# Altium schematic sheet Sheet1.SchDoc
size OrCAD A; SheetNumber: 1; SheetTotal: 1
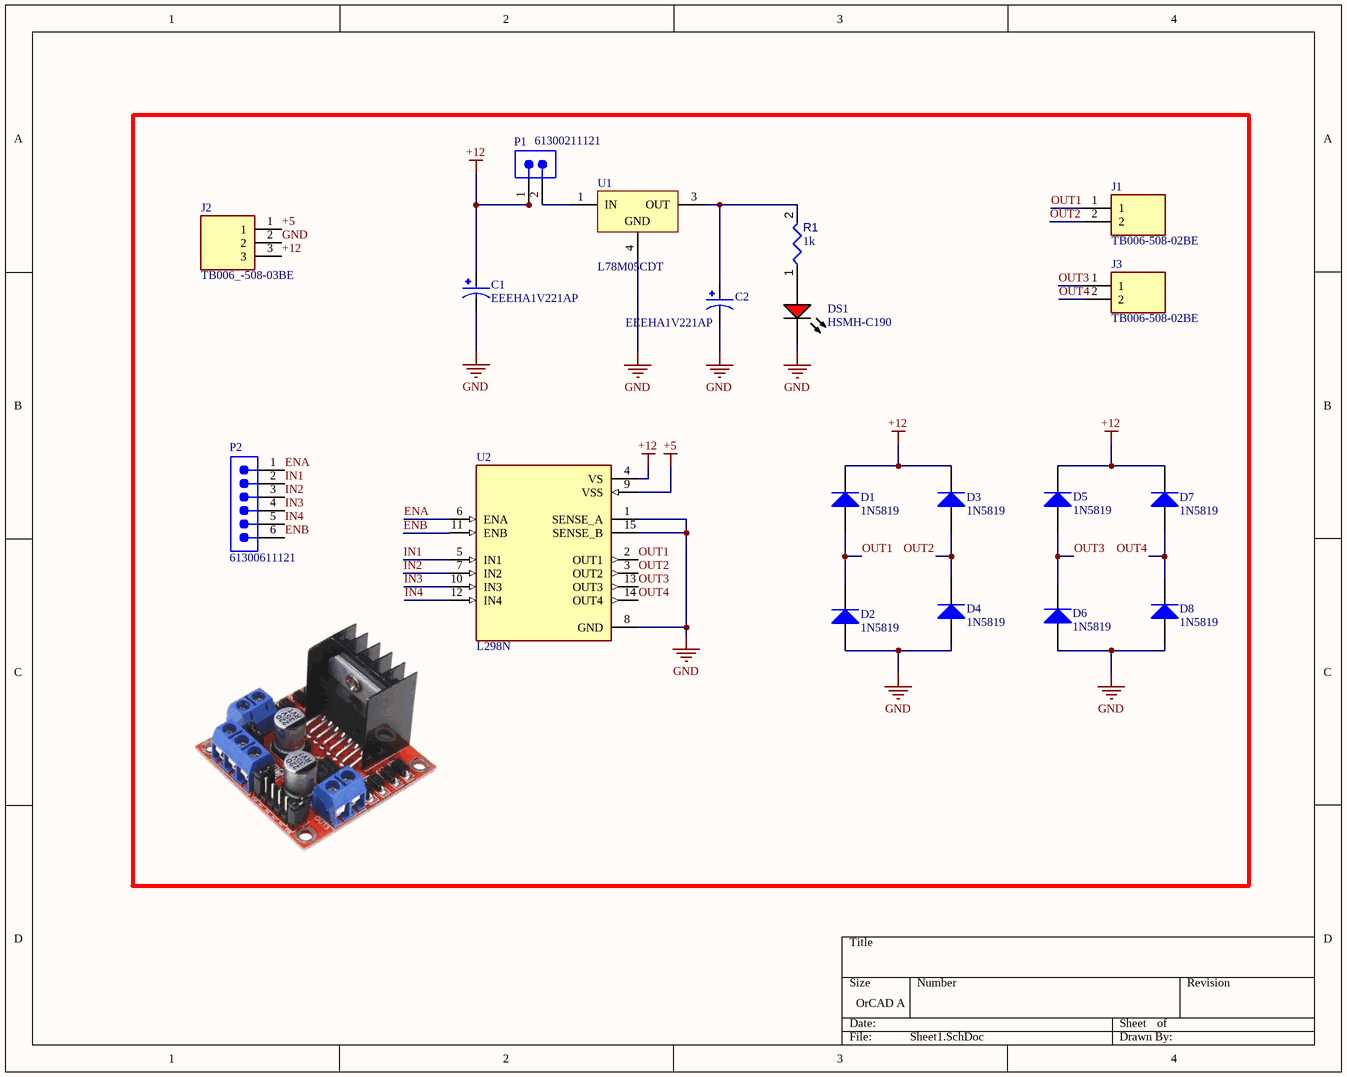
[diagram p0: Sheet1.SchDoc]

## Parts
C1  EEEHA1V221AP  [CAP_EEEHA1V221AP]
C2  EEEHA1V221AP  [CAP_EEEHA1V221AP]
D1  1N5819  [ONSC-AXIAL_LEAD-2-59-10_P]
D2  1N5819  [ONSC-AXIAL_LEAD-2-59-10_P]
D3  1N5819  [ONSC-AXIAL_LEAD-2-59-10_P]
D4  1N5819  [ONSC-AXIAL_LEAD-2-59-10_P]
D5  1N5819  [ONSC-AXIAL_LEAD-2-59-10_P]
D6  1N5819  [ONSC-AXIAL_LEAD-2-59-10_P]
D7  1N5819  [ONSC-AXIAL_LEAD-2-59-10_P]
D8  1N5819  [ONSC-AXIAL_LEAD-2-59-10_P]
DS1  HSMH-C190  [AVAG-HSMX-C190_V]
J1  TB006-508-02BE  [CUI_TB006-508-02BE]
J2  TB006_-508-03BE  [CUI_TB006 -508-03BE]
J3  TB006-508-02BE  [CUI_TB006-508-02BE]
P1  61300211121  [61300211121]
P2  61300611121  [61300611121]
R1  value 1k  [RESC0402(1005)_L]  (hidden comment: Resistor 1K +/-5 % 0402 63 mW)
U1  L78M05CDT  [STM-TO252-3_A_V]
U2  L298N  [TO127P2020X500X2100-15]

## Nets
+5: J2.1 U2.9(VSS)
+12: C1.1 D1.2(K) D3.2(K) D5.2(K) D7.2(K) J2.3 P1.1 U2.4(VS)
GND: C1.2 C2.2 D2.1(A) D4.1(A) D6.1(A) D8.1(A) DS1.2(K) J2.2 U1.4(GND) U2.1(SENSE_A) U2.8(GND) U2.15(SENSE_B)
ENA: P2.1 U2.6(ENA)
ENB: P2.6 U2.11(ENB)
IN1: P2.2 U2.5(IN1)
IN2: P2.3 U2.7(IN2)
IN3: P2.4 U2.10(IN3)
IN4: P2.5 U2.12(IN4)
OUT1: D1.1(A) D2.2(K) J1.1 U2.2(OUT1)
OUT2: D3.1(A) D4.2(K) J1.2 U2.3(OUT2)
OUT3: D5.1(A) D6.2(K) J3.1 U2.13(OUT3)
OUT4: D7.1(A) D8.2(K) J3.2 U2.14(OUT4)
NetC2_1: C2.1 R1.2 U1.3(OUT)
NetDS1_1: DS1.1(A) R1.1
NetP1_2: P1.2 U1.1(IN)

## Library data of the parts
C1 C2 = EEEHA1V221AP: 220ÂµF 35V Aluminum Electrolytic Capacitors Radial, Can - SMD 1000 Hrs @ 105Â°C; MP: EEE-HA1V221AP; MF: Panasonic; SnapEDA_Link: https://www.snapeda.com/parts/EEE-HA1V221AP/Panasonic/view-part/?ref=snap; Package: RADIAL-2 Panasonic; Availability: In Stock; Price: None; Purchase-URL: https://pricing.snapeda.com/search/part/EEE-HA1V221AP/?ref=eda; Check_prices: https://www.snapeda.com/parts/EEE-HA1V221AP/Panasonic/view-part/?ref=eda; Value: *
D1-D8 = CMP-004-00009-2: Low Drop Power Schottky Rectifier, 40 V, 1 A, 2-Pin DO-41, RoHS; Manufacturer: ON Semiconductor; Max Surge Current: 25A; Forward Current: 1A; Package Version: Rev. U, 02/2005; Peak Reverse Current: 1mA; Max Operating Temperature: 125°C; Case/Package: DO; Package URL: http://www.onsemi.cn/pub_link/Collateral/59-10.PDF; Packaging: Bulk; Manufacturer URL: http://www.onsemi.com/; Min Operating Temperature: -65°C; Package Description: 2-Pin, Axial Lead, Diameter 2.35 mm; Mounting Technology: TH; Datasheet URL: http://www.onsemi.cn/pub_link/Collateral/1N5817-D.PDF; Datasheet Version: Rev. 10, 07/2006; Package Reference: AXIAL_LEAD-2-59-10; Pins: 2; RoHS Compliant: True
DS1 = CMP-007-00014-2: LED Uni-Color Red, 65 mW, 20 mA, -40 to 85 degC, 2-Pin SMD, RoHS, Tape and Reel; Manufacturer: Avago; Nominal Vf: 1.8V; Luminous Intensity: 17mcd; Power: 78mW; Forward Current: 20mA; Lens Style: Diffused; Viewing Angle: 170degrees; Package Quantity: 4000; Colour: Red; Manufacturer URL: http://www.avagotech.com/; Min Operating Temperature: -40°C; Datasheet URL: http://docs.avagotech.com/docs/AV02-0551EN; RoHS Compliant: True; Forward Voltage: 1.8V; Pins: 2; Max Operating Temperature: 85°C; Packaging: TapeandReel; Package Reference: HSMX-C190; Datasheet Version: Mar-12; Package Description: 2-Pin Surface Mount Device, Body 1.6 x 0.8 mm, Height 0.9 mm; Case/Package: 0603; Mounting Technology: SM; Illumination Colour: Red
J1 J3 = TB006-508-02BE: 2~24 Poles, Screw Type, Horizontal, 5.08 Pitch, 26~14 (AWG), Terminal Block Connector; MF: Same Sky; SnapEDA_Link: https://www.snapeda.com/parts/TB006-508-02BE/Same+Sky/view-part/?ref=snap; Package: None; Value: *; MP: TB006-508-02BE; Check_prices: https://www.snapeda.com/parts/TB006-508-02BE/Same+Sky/view-part/?ref=eda
J2 = TB006_-508-03BE: 2~24 Poles, Screw Type, Horizontal, 5.08 Pitch, 26~14 (AWG), Terminal Block Connector; MF: CUI Devices; MP: TB006 -508-03BE; Purchase-URL: https://pricing.snapeda.com/search/part/TB006 -508-03BE/?ref=eda; Package: None; Check_prices: https://www.snapeda.com/parts/TB006%20-508-03BE/CUI+Devices/view-part/?ref=eda; Value: *; CUI_purchase_URL: https://www.cuidevices.com/product/interconnect/connectors/terminal-blocks/tb006-508-series?utm_source=snapeda.com&utm_medium=referral&utm_campaign=snapedaBOM; SnapEDA_Link: https://www.snapeda.com/parts/TB006%20-508-03BE/CUI+Devices/view-part/?ref=snap; Availability: In Stock; Price: None
P1 = CMP-1712-00002-6: NexarPartId: 20081794; Number of Contacts: 2; Pitch: 2.54mm; Connector Type: Male Pin; Voltage Rating: 250V; Current Rating: 3A; Gender: Male; Contact Resistance: 20mΩ; Height: 8.94mm; Lead Free: Lead Free; Number of Pins: 2; Termination: Through Hole; RoHS: Compliant; Lead Pitch: 2.54mm; REACH SVHC: No SVHC; Housing Material: PBT; Contact Mating Length: 5.9944mm; Min Operating Temperature: -40°C; Orientation: Vertical; Contact Material: Copper; Contact Gender: Male; Max Operating Temperature: 125°C; Number of Rows: 1; Number of Positions: 2; Packaging: Bulk; Contact Plating: Gold; Mount: Through Hole; Color: Black; Operating Supply Voltage: 250V
P2 = CMP-1502-01070-3: NexarPartId: 20084590; Current Rating: 3A; Pitch: 2.54mm; Gender: Male; Operating Supply Voltage: 250V; Connector Type: Male Pin; Number of Positions: 6; Contact Resistance: 20mΩ; Packaging: Bulk; Number of Pins: 6; Number of Rows: 1; Contact Plating: Gold; Lead Free: Lead Free; RoHS: Compliant; Contact Mating Length: 5.9944mm; Voltage Rating: 250V; REACH SVHC: Unknown; Contact Gender: Male; Housing Material: PBT; Min Operating Temperature: -40°C; Lead Pitch: 2.54mm; Mount: Through Hole; Number of Contacts: 6; Max Operating Temperature: 105°C; Contact Material: Copper; Orientation: Vertical; Termination: Through Hole; Color: Black; Height: 8.89mm
R1 = CMP-009-00157-3: Chip Resistor, 1 kOhms, +/-5 %, 63 mW, -55 to 155 degC, 0402; Tolerance: 5%; Power: 63mW; Case/Package: 0402; Pins: 2; Min Operating Temperature: -55°C; Max Operating Temperature: 155°C
U1 = CMP-2000-06530-1: Precision Regulator, 0.5 A, 5 V Output, 0 to 150 degC, 3-Pin DPAK (TO252), RoHS, Tube; Manufacturer: STMicroelectronics; No. of Pins: 3Pins; SVHC: NoSVHC(17-Dec-2015); Input Voltage Max: 35V; Linear Regulator Case Style: TO-252; Output Voltage Nom.: 5V; Output Current: 500mA; Input Voltage Min: 10V; Manufacturer URL: http://www.st.com/; Operating Temperature Min: 0°C; Package Description: 3-Pin Transistor Outline, Body 6.5 x 6.1 mm, Pitch 2.28 mm; Package Reference: TO252; Datasheet Version: Rev. 20, 06/2014; Packaging: Each; Mounting Technology: SurfaceMount; Operating Temperature Max: 150°C; Datasheet URL: http://www.st.com/content/ccc/resource/technical/document/datasheet/d7/5f/dc/5c/d5/b6/48/7c/CD00000447.pdf/files/CD00000447.pdf/jcr:content/translations/en.CD00000447.pdf
U2 = L298N: Dual Full Bridge Motor Driver 15-Pin(15+Tab) MULTIWATT V Tube; MP: L298N; Availability: Unavailable; Package: None; Value: *; Price: None